# Altium schematic sheet IMX477_MIPI_HDMI.SchDoc
size A1
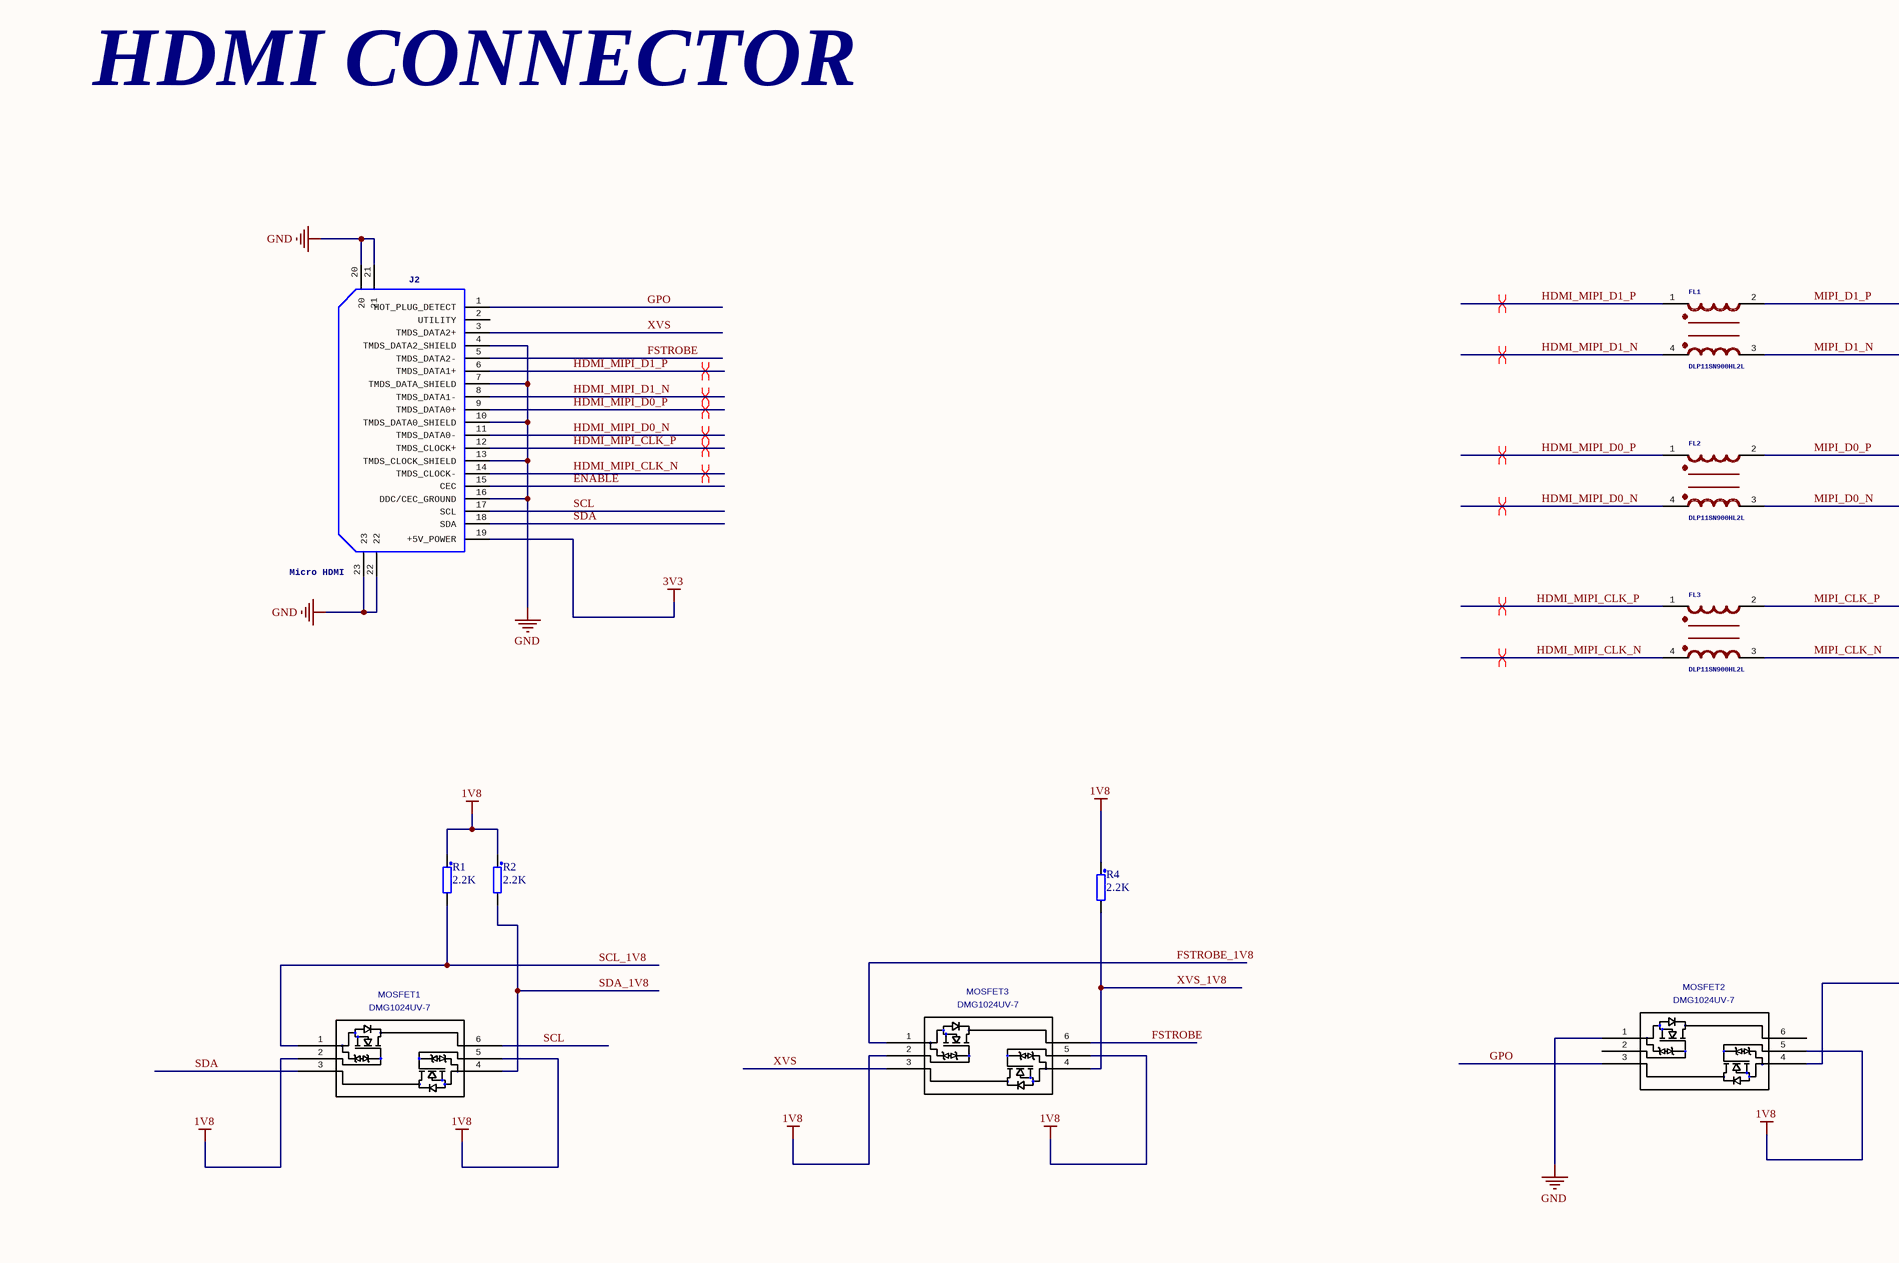
[diagram p0: IMX477_MIPI_HDMI.SchDoc, top left]
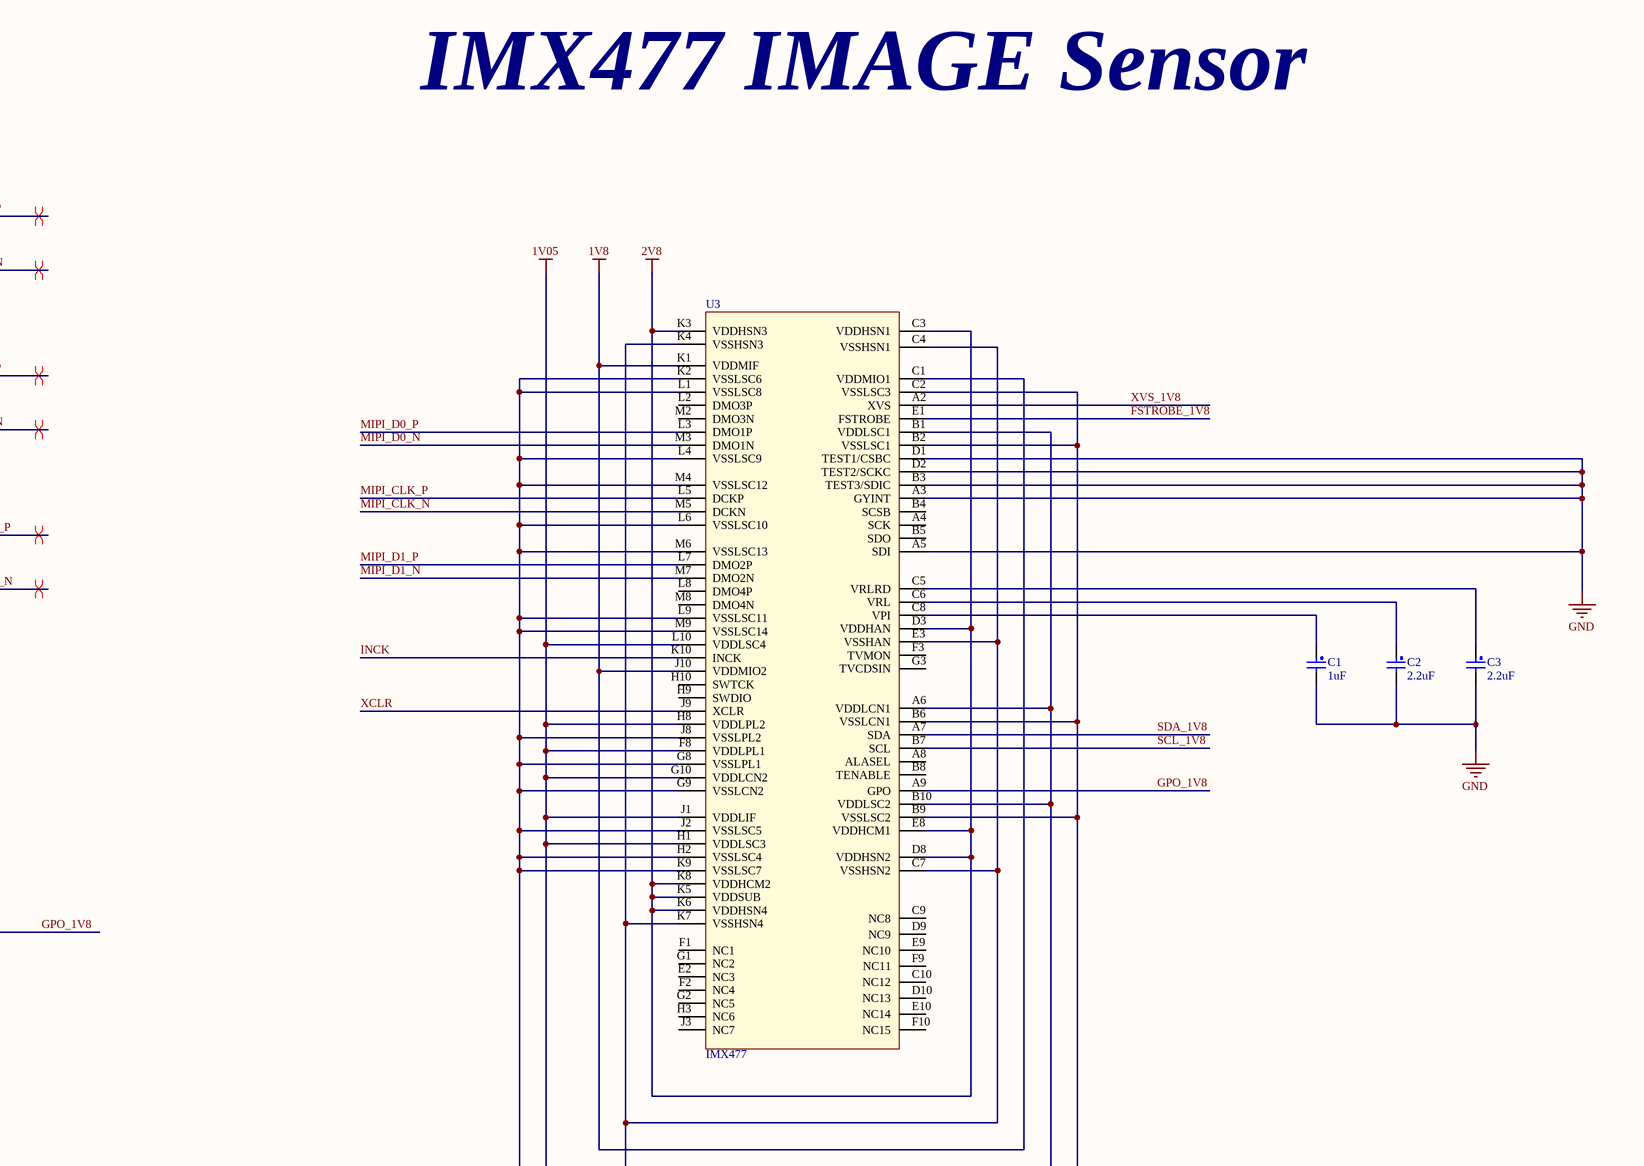
[diagram p1: IMX477_MIPI_HDMI.SchDoc, top right]
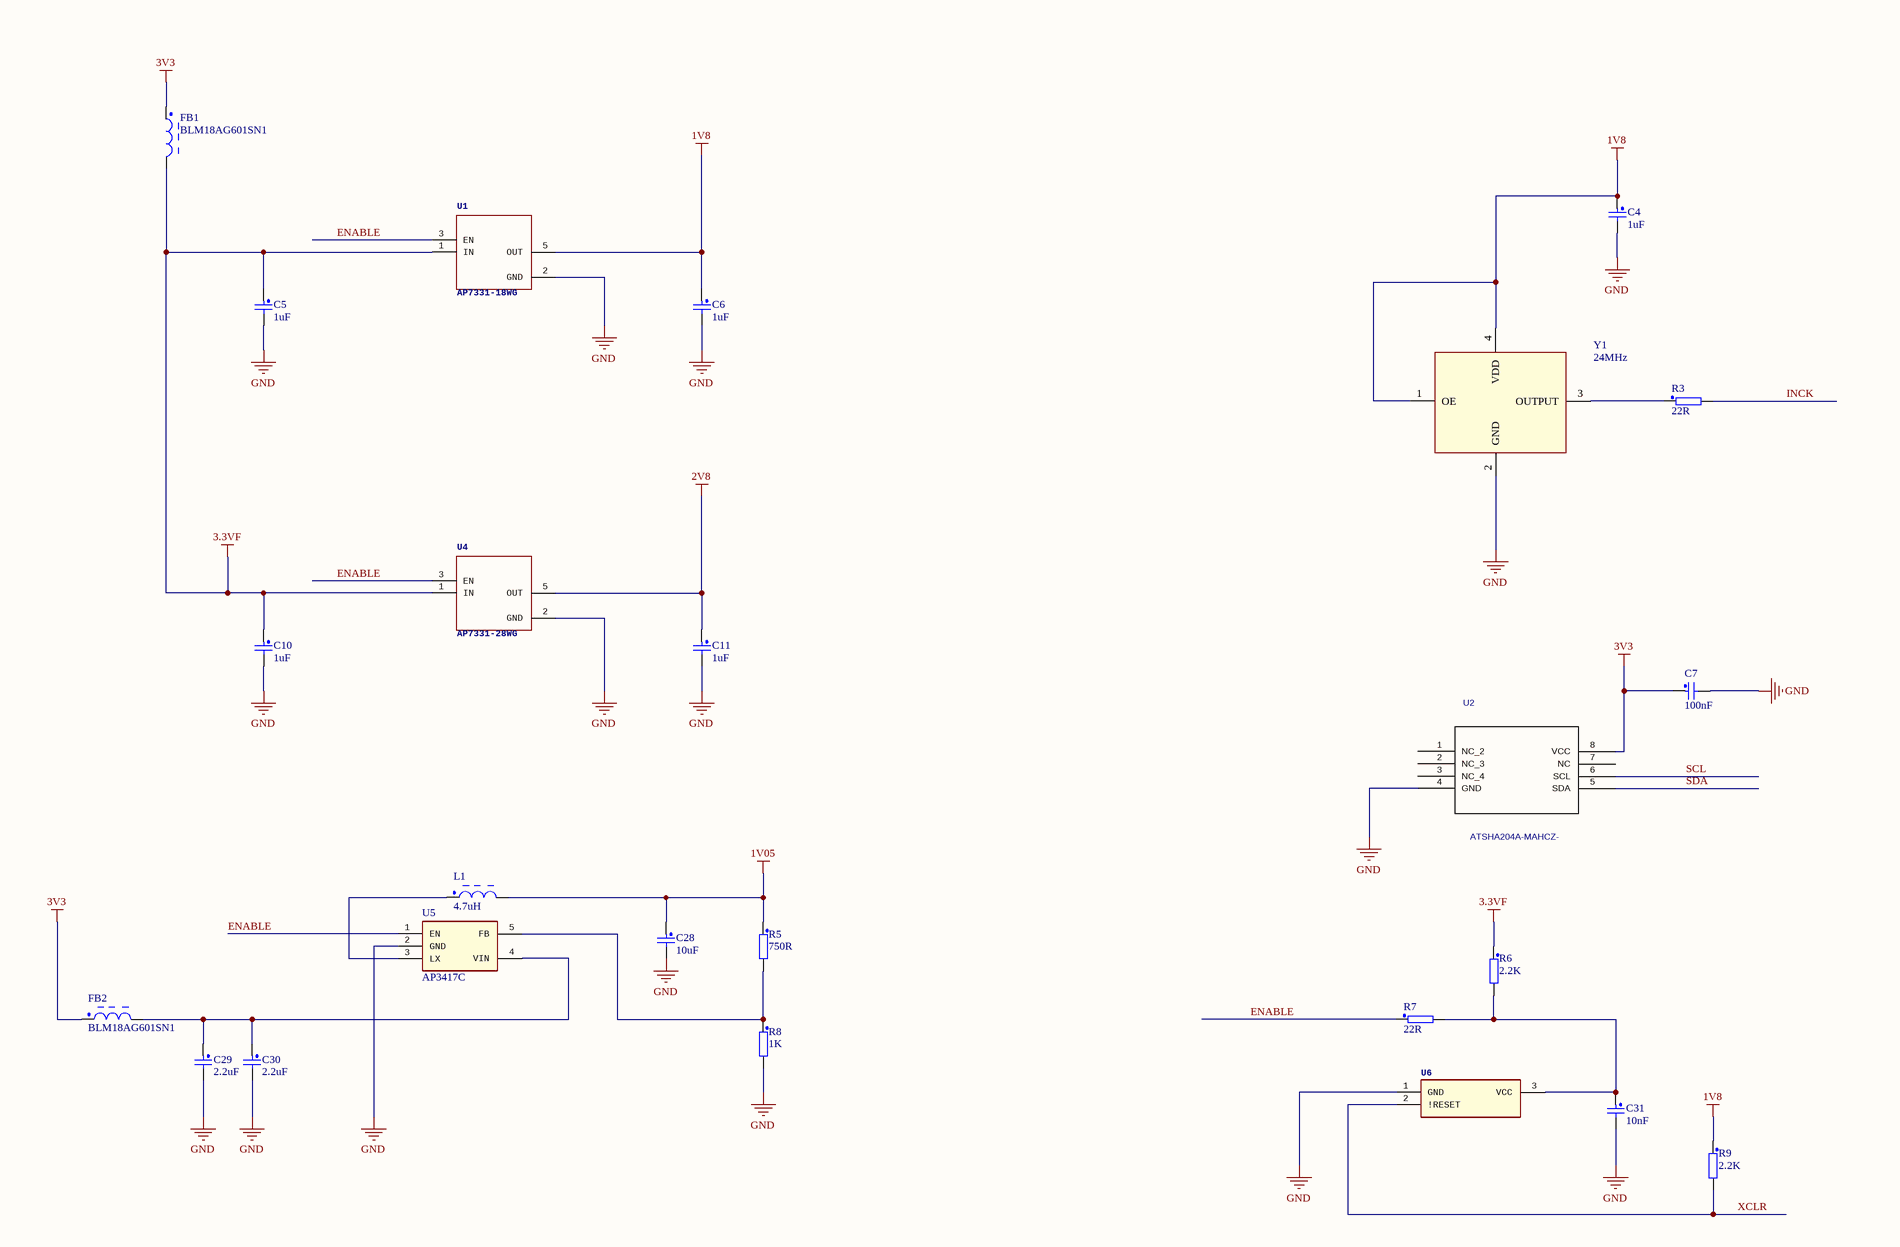
[diagram p2: IMX477_MIPI_HDMI.SchDoc, bottom left]
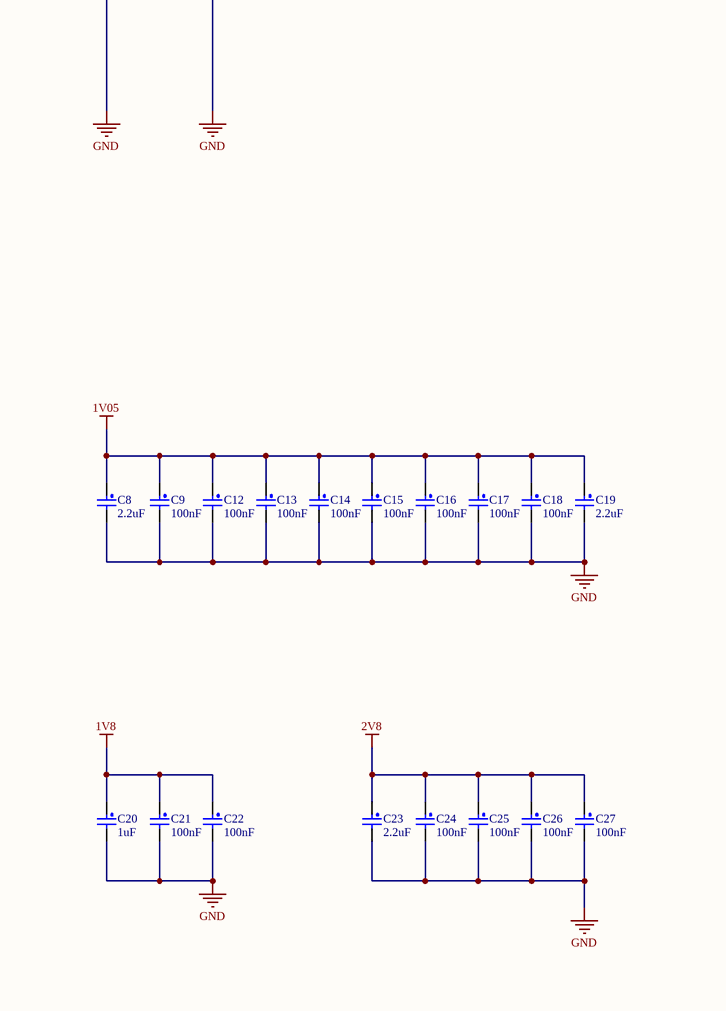
[diagram p3: IMX477_MIPI_HDMI.SchDoc, bottom right]

## Parts
C1  1uF  [CAP-0402]
C2  2.2uF  [CAP-0603]
C3  2.2uF  [CAP-0603]
C4  1uF  [CAP-0402]
C5  1uF  [CAP-0402]
C6  1uF  [CAP-0402]
C7  100nF  [CAP-0402]
C8  2.2uF  [CAP-0603]
C9  100nF  [CAP-0402]
C10  1uF  [CAP-0402]
C11  1uF  [CAP-0402]
C12  100nF  [CAP-0402]
C13  100nF  [CAP-0402]
C14  100nF  [CAP-0402]
C15  100nF  [CAP-0402]
C16  100nF  [CAP-0402]
C17  100nF  [CAP-0402]
C18  100nF  [CAP-0402]
C19  2.2uF  [CAP-0603]
C20  1uF  [CAP-0402]
C21  100nF  [CAP-0402]
C22  100nF  [CAP-0402]
C23  2.2uF  [CAP-0603]
C24  100nF  [CAP-0402]
C25  100nF  [CAP-0402]
C26  100nF  [CAP-0402]
C27  100nF  [CAP-0402]
C28  10uF  [CAP-0805-S]
C29  2.2uF  [CAP-0603]
C30  2.2uF  [CAP-0603]
C31  10nF  [CAP-0402]
FB1  BLM18AG601SN1  [FBD-0603-S]
FB2  BLM18AG601SN1  [FBD-0603-S]
FL1  DLP11SN900HL2L  [DLP11SN900HL2L]
FL2  DLP11SN900HL2L  [DLP11SN900HL2L]
FL3  DLP11SN900HL2L  [DLP11SN900HL2L]
J2  Micro HDMI  [HDMI-0467650301]
L1  4.7uH  [IND-1008]
MOSFET1  DMG1024UV-7  [SOT-563_DIO]
MOSFET2  DMG1024UV-7  [SOT-563_DIO]
MOSFET3  DMG1024UV-7  [SOT-563_DIO]
R1  2.2K  [RES-0402]
R2  2.2K  [RES-0402]
R3  22R  [RES-0402]
R4  2.2K  [RES-0402]
R5  750R  [RES-0402]
R6  2.2K  [RES-0402]
R7  22R  [RES-0402]
R8  1K  [RES-0402]
R9  2.2K  [RES-0402]
U1  AP7331-18WG  [AP7331-sot-25]
U2  ATSHA204A-MAHCZ-  [ATSHA204A]
U3  IMX477  [IMX477]
U4  AP7331-28WG  [AP7331-sot-25]
U5  AP3417C  [SOT23-5-3D]
U6  (no value)  [SOT96P240X110-3N]
Y1  24MHz  [3225-OSC]

## Nets
1V05: C8.1 C9.1 C12.1 C13.1 C14.1 C15.1 C16.1 C17.1 C18.1 C19.1 C28.1 L1.2 R5.1 U3.A6(VDDLCN1) U3.B1(VDDLSC1) U3.B10(VDDLSC2) U3.F8(VDDLPL1) U3.G10(VDDLCN2) U3.H1(VDDLSC3) U3.H8(VDDLPL2) U3.J1(VDDLIF) U3.L10(VDDLSC4)
1V8: C4.1 C6.1 C20.1 C21.1 C22.1 MOSFET1.2(G2) MOSFET1.5(G1) MOSFET2.5(G1) MOSFET3.2(G2) MOSFET3.5(G1) R1.1 R2.1 R4.1 R9.1 U1.5(OUT) U3.C1(VDDMIO1) U3.J10(VDDMIO2) U3.K1(VDDMIF) Y1.1(OE) Y1.4(VDD)
2V8: C11.1 C23.1 C24.1 C25.1 C26.1 C27.1 U3.C3(VDDHSN1) U3.D3(VDDHAN) U3.D8(VDDHSN2) U3.E8(VDDHCM1) U3.K3(VDDHSN3) U3.K5(VDDSUB) U3.K6(VDDHSN4) U3.K8(VDDHCM2) U4.5(OUT)
3.3VF: C5.1 C10.1 FB1.2 R6.1 U1.1(IN) U4.1(IN)
3V3: C7.1 FB1.1 FB2.1 J2.19(+5V_POWER) U2.8(VCC)
GND: C1.2 C2.2 C3.2 C4.2 C5.2 C6.2 C7.2 C8.2 C9.2 C10.2 C11.2 C12.2 C13.2 C14.2 C15.2 C16.2 C17.2 C18.2 C19.2 C20.2 C21.2 C22.2 C23.2 C24.2 C25.2 C26.2 C27.2 C28.2 C29.2 C30.2 C31.2 J2.4(TMDS_DATA2_SHIELD) J2.7(TMDS_DATA_SHIELD) J2.10(TMDS_DATA0_SHIELD) J2.13(TMDS_CLOCK_SHIELD) J2.16(DDC/CEC_GROUND) J2.20 J2.21 J2.22 J2.23 MOSFET2.1(S2) R8.2 U1.2(GND) U2.4(GND) U3.A3(GYINT) U3.A5(SDI) U3.B2(VSSLSC1) U3.B3(TEST3/SDIC) U3.B6(VSSLCN1) U3.B9(VSSLSC2) U3.C2(VSSLSC3) U3.C4(VSSHSN1) U3.C7(VSSHSN2) U3.D1(TEST1/CSBC) U3.D2(TEST2/SCKC) U3.E3(VSSHAN) U3.G8(VSSLPL1) U3.G9(VSSLCN2) U3.H2(VSSLSC4) U3.J2(VSSLSC5) U3.J8(VSSLPL2) U3.K2(VSSLSC6) U3.K4(VSSHSN3) U3.K7(VSSHSN4) U3.K9(VSSLSC7) U3.L1(VSSLSC8) U3.L4(VSSLSC9) U3.L6(VSSLSC10) U3.L9(VSSLSC11) U3.M4(VSSLSC12) U3.M6(VSSLSC13) U3.M9(VSSLSC14) U4.2(GND) U5.2(GND) U6.1(GND) Y1.2(GND)
ENABLE: J2.15(CEC) R7.1 U1.3(EN) U4.3(EN) U5.1(EN)
FSTROBE: J2.5(TMDS_DATA2-) MOSFET3.6(D2)
FSTROBE_1V8: MOSFET3.1(S2) U3.E1(FSTROBE)
GPO: J2.1(HOT_PLUG_DETECT) MOSFET2.3(D1)
GPO_1V8: MOSFET2.4(S1) U3.A9(GPO)
HDMI_MIPI_CLK_N: FL3.4 J2.14(TMDS_CLOCK-)
HDMI_MIPI_CLK_P: FL3.1 J2.12(TMDS_CLOCK+)
HDMI_MIPI_D0_N: FL2.4 J2.11(TMDS_DATA0-)
HDMI_MIPI_D0_P: FL2.1 J2.9(TMDS_DATA0+)
HDMI_MIPI_D1_N: FL1.4 J2.8(TMDS_DATA1-)
HDMI_MIPI_D1_P: FL1.1 J2.6(TMDS_DATA1+)
INCK: R3.2 U3.K10(INCK)
MIPI_CLK_N: FL3.3 U3.M5(DCKN)
MIPI_CLK_P: FL3.2 U3.L5(DCKP)
MIPI_D0_N: FL2.3 U3.M3(DMO1N)
MIPI_D0_P: FL2.2 U3.L3(DMO1P)
MIPI_D1_N: FL1.3 U3.M7(DMO2N)
MIPI_D1_P: FL1.2 U3.L7(DMO2P)
SCL: J2.17(SCL) MOSFET1.6(D2) U2.6(SCL)
SCL_1V8: MOSFET1.1(S2) R1.2 U3.B7(SCL)
SDA: J2.18(SDA) MOSFET1.3(D1) U2.5(SDA)
SDA_1V8: MOSFET1.4(S1) R2.2 U3.A7(SDA)
XCLR: R9.2 U3.J9(XCLR) U6.2(!RESET)
XVS: J2.3(TMDS_DATA2+) MOSFET3.3(D1)
XVS_1V8: MOSFET3.4(S1) R4.2 U3.A2(XVS)
NetC1_1: C1.1 U3.C8(VPI)
NetC2_1: C2.1 U3.C6(VRL)
NetC3_1: C3.1 U3.C5(VRLRD)
NetC29_1: C29.1 C30.1 FB2.2 U5.4(VIN)
NetC31_1: C31.1 R6.2 R7.2 U6.3(VCC)
NetL1_1: L1.1 U5.3(LX)
NetR3_1: R3.1 Y1.3(OUTPUT)
NetR5_2: R5.2 R8.1 U5.5(FB)

Not connected (* = marked no-connect by the designer): J2 2(UTILITY); MOSFET2 2(G2) 6(D2); U2 1(NC_2) 2(NC_3) 3(NC_4) 7(NC); U3 A4(SCK) A8(ALASEL) B4(SCSB) B5(SDO) B8(TENABLE) C9(NC8) C10(NC12) D9(NC9) D10(NC13) E2(NC3) E9(NC10) E10(NC14) F1(NC1) F2(NC4) F3(TVMON) F9(NC11) F10(NC15) G1(NC2) G2(NC5) G3(TVCDSIN) H3(NC6) H9(SWDIO) H10(SWTCK) J3(NC7) L2(DMO3P) L8(DMO4P) M2(DMO3N) M8(DMO4N)

## Layout directives
differential pair: HDMI_MIPI_CLK_N, HDMI_MIPI_CLK_P, HDMI_MIPI_D0_N, HDMI_MIPI_D0_P, HDMI_MIPI_D1_N, HDMI_MIPI_D1_P, MIPI_CLK_N, MIPI_CLK_P, MIPI_D0_N, MIPI_D0_P, MIPI_D1_N, MIPI_D1_P

## Notes on the sheet
- HDMI CONNECTOR
- IMX477 IMAGE Sensor

## Library data of the parts
C1-C31 = CAP: Capacitor
FB1 FB2 L1 = INDUCTOR
FL1-FL3 = DLP11SN900HL2L: GateName_1: G$1; MF: Murata; SymbolName_1: DLP11SN900HL2L; LibraryName: DLP11SN900HL2L; DeviceSetName: DLP11SN900HL2L; Package: FIL_DLP11SN900HL2L; MP: DLP11SN900HL2L; Package: 1210 Murata; Mouser-Purchase-URL: https://snapeda.com/shop?store=Mouser&id=4300514; Digi-Key_Part_Number: 490-5143-1-ND
J2 = HDMI-0467650301: Manufacturer_Name: Molex; GateName_1: G$1; SymbolName_1: 0467650301; LibraryName: 0467650301; DeviceSetName: 0467650301; Package: 0467650301; Manufacturer_Part_Number: 0467650301; Arrow_Part_Number: 0467650301; Arrow_Price-Stock: https://www.arrow.com/en/products/0467650301/molex; Height: 3mm
MOSFET1-MOSFET3 = DMG1024UV-7: C: Copyright (C) 2018 Accelerated Designs. All rights reserved; Vendor: Diodes Inc; Built_By: EMA_Cory; SourceLibrary: Diodes_Inc_2020-03-09; Value: DMG1024UV-7; Datasheet: https://www.diodes.com/assets/Datasheets/ds31974.pdf; Manufacturer_Part_Number: DMG1024UV-7; Copyright: Copyright (C) 2018 Accelerated Designs. All rights reserved
R1-R9 = RES
U1 U4 = AP7331-xxWG-7: GateName_1: G$1; SymbolName_1: AP7331-18WG-7; MF: Diodes Inc.; LibraryName: AP7331-18WG-7; DeviceSetName: AP7331-18WG-7; Package: SOT95P285X145-5N; MP: AP7331-18WG-7; Mouser-Purchase-URL: https://snapeda.com/shop?store=Mouser&id=494406; Package: SOT-753 Diodes Inc.; Digi-Key_Part_Number: AP7331-18WG-7DICT-ND
U2 = ATSHA204A-MAHCZ-: Manufacturer_Part_Number: ATSHA204A-MAHCZ-T; SourceLibrary: Microchip_2019-08-23_25; Built_By: EMA_Molly; Vendor: Microchip; Value: ATSHA204A-MAHCZ-; Copyright: Copyright (C) 2018 Accelerated Designs. All rights reserved
U6 = APX803-29SAG-7: Manufacturer_Name: Diodes Inc.; GateName_1: G$1; SymbolName_1: APX803-29SAG-7; LibraryName: APX803-29SAG-7; DeviceSetName: APX803-29SAG-7; Package: SOT96P240X110-3N; Manufacturer_Part_Number: APX803-29SAG-7; Arrow_Part_Number: APX803-29SAG-7; Arrow_Price-Stock: https://www.arrow.com/en/products/apx803-29sag-7/diodes-incorporated; Mouser_Part_Number: 621-APX803-29SAG-7; Mouser_Price-Stock: https://www.mouser.com/Search/Refine.aspx?Keyword=621-APX803-29SAG-7; Height: 1.1mm
Y1 = OSC-3225